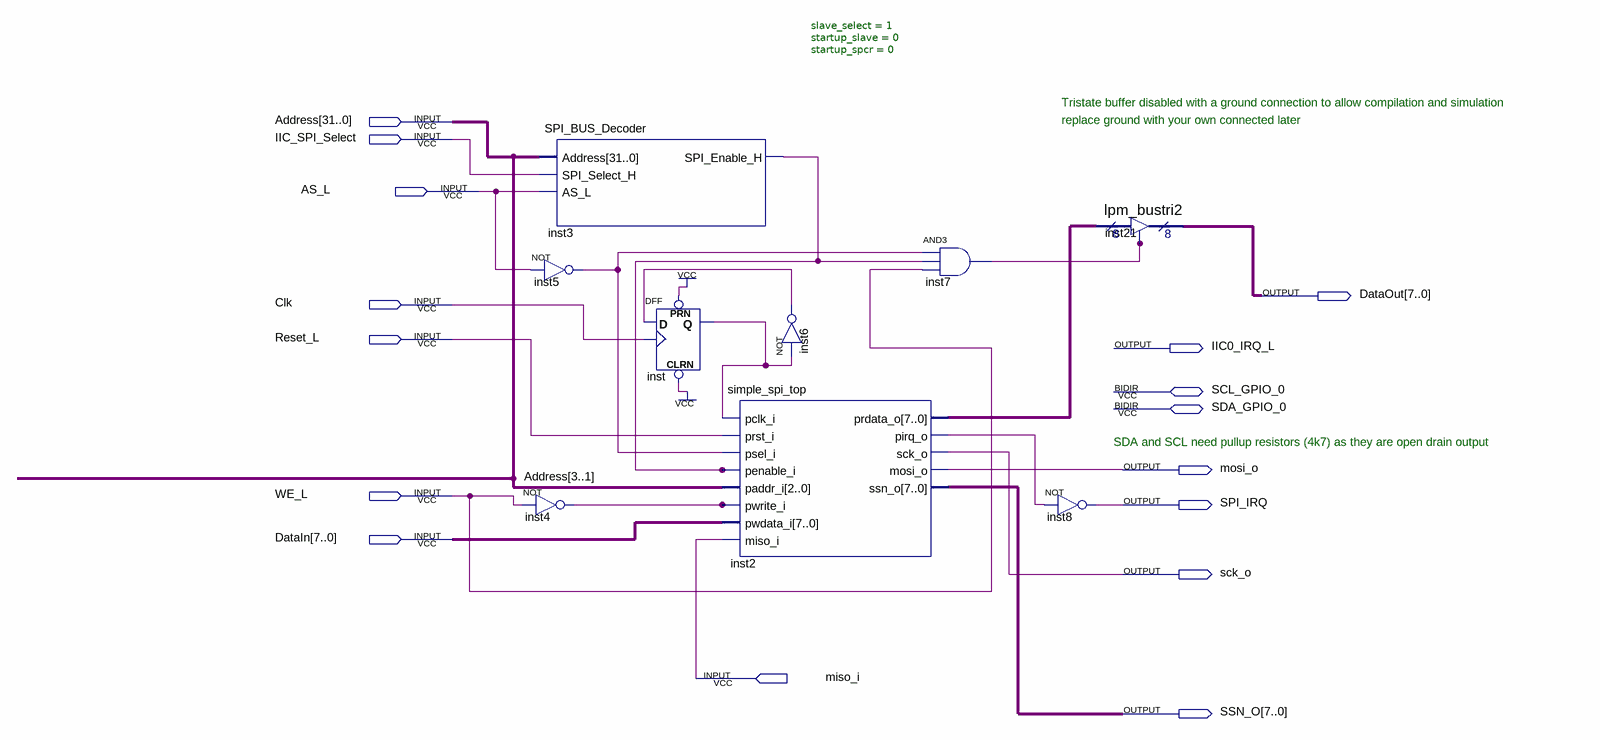
[diagram p0: schematic sheet]
// Quartus schematic IIC_SPI_Interface.bdf as structural Verilog: 9 symbols, 16 pins
module IIC_SPI_Interface (
  input  [31:0] Address,
  input  IIC_SPI_Select,
  input  AS_L,
  input  Clk,
  input  Reset_L,
  input  WE_L,
  input  [7:0] DataIn,
  input  miso_i,
  inout  SCL_GPIO_0,
  inout  SDA_GPIO_0,
  output [7:0] DataOut,
  output IIC0_IRQ_L,
  output mosi_o,
  output SPI_IRQ,
  output sck_o,
  output [7:0] SSN_O
);

  wire inst2_pirq_o, inst3_spi_enable_h, inst4_out, inst5_out, inst6_out, inst7_out, inst_q;
  wire [7:0] inst2_prdata_o;

  SPI_BUS_Decoder inst3 (
    .Address(Address), .SPI_Select_H(IIC_SPI_Select), .AS_L(AS_L), .SPI_Enable_H(inst3_spi_enable_h));
  not inst5 (inst5_out, AS_L);
  not inst4 (inst4_out, WE_L);
  DFF inst (.CLRN(1'b1), .CLK(Clk), .D(inst6_out), .PRN(1'b1), .Q(inst_q));
  simple_spi_top #(.slave_select(1), .startup_slave(0), .startup_spcr(0)) inst2 (
    .pclk_i(inst_q), .prst_i(Reset_L), .psel_i(inst5_out), .penable_i(inst3_spi_enable_h),
    .paddr_i(Address[3:1]), .pwrite_i(inst4_out), .pwdata_i(DataIn), .miso_i(miso_i),
    .prdata_o(inst2_prdata_o), .pirq_o(inst2_pirq_o), .sck_o(sck_o), .mosi_o(mosi_o), .ssn_o(SSN_O));
  not inst6 (inst6_out, inst_q);
  and inst7 (inst7_out, inst5_out, inst3_spi_enable_h, WE_L);
  lpm_bustri2 inst21 (.enabledt(inst7_out), .data(inst2_prdata_o), .tridata(DataOut));
  not inst8 (SPI_IRQ, inst2_pirq_o);

  // Notes on the sheet:
  //   Tristate buffer disabled with a ground connection to allow compilation and simulation
  //   replace ground with your own connected later
  //   SDA and SCL need pullup resistors (4k7) as they are open drain output
endmodule
